# Altium project MSP-GSM.PRJPCB
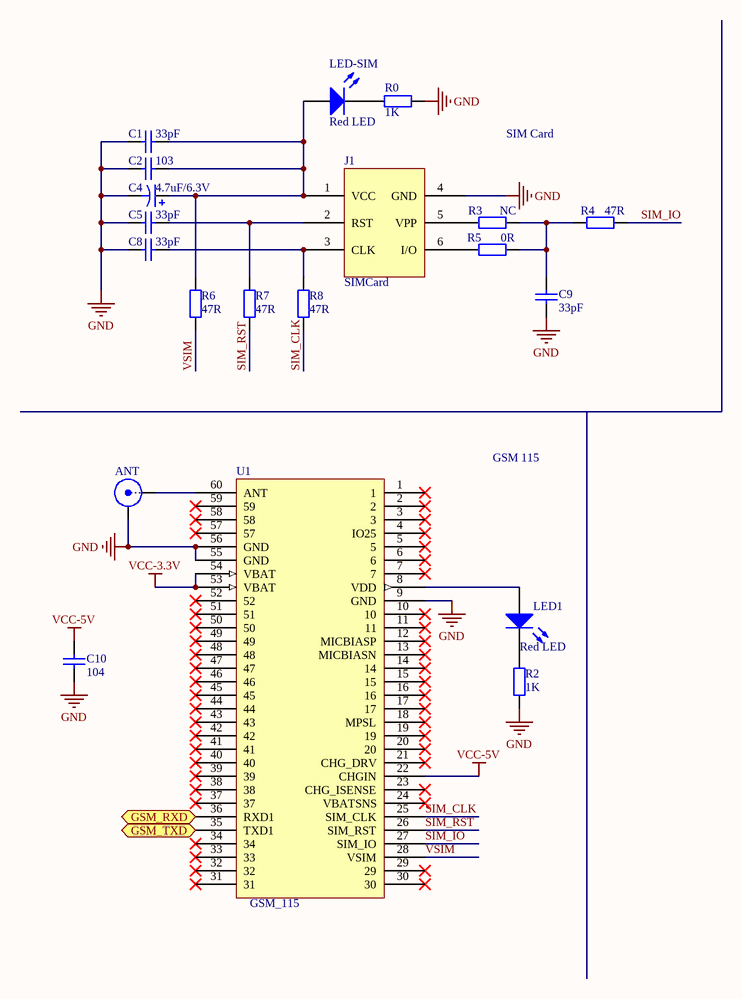
[diagram p0: GSMPart.SchDoc]
2 sheets, 94 parts. Net scope: flat (ports and power ports of the same name join across sheets).
Board file: MSP_GSM_Borad.PcbDoc
Sheets:
  GSMPart.SchDoc
  MSP.SchDoc

## Sheet GSMPart.SchDoc
size A

### Parts
ANT  SMB  [SMB_V-RJ45]  (value not drawn)
C1  value 33pF  [1608[0603]]  (hidden comment: Cap)
C2  value 103  [1608[0603]]  (hidden comment: Cap)
C4  value 4.7uF/6.3V  [B]  (hidden comment: CAP POL)
C5  value 33pF  [1608[0603]]  (hidden comment: Cap)
C8  value 33pF  [1608[0603]]  (hidden comment: Cap)
C9  value 33pF  [1608[0603]]  (hidden comment: Cap)
C10  value 104  [1608[0603]]  (hidden comment: Cap)
J1  SIMCard  [PCB_SIM]
LED1  Red LED  [2012[0805] - POL]
LED-SIM  Red LED  [2012[0805] - POL]
R0  value 1K  [1608[0603]]  (hidden comment: RES)
R2  value 1K  [1608[0603]]  (hidden comment: RES)
R3  value NC  [1608[0603]]  (hidden comment: RES)
R4  value 47R  [1608[0603]]  (hidden comment: RES)
R5  value 0R  [1608[0603]]  (hidden comment: RES)
R6  value 47R  [1608[0603]]  (hidden comment: RES)
R7  value 47R  [1608[0603]]  (hidden comment: RES)
R8  value 47R  [1608[0603]]  (hidden comment: RES)
U1  GSM_115

### Ports
GSM_RXD, GSM_TXD

### Nets
GND: ANT.2(Y) C1.1 C2.1 C4.2 C5.1 C8.1 C9.1 C10.1 J1.4(GND) R0.1 R2.1 U1.9(GND) U1.55(GND) U1.56(GND)
VCC-3.3V: U1.53(VBAT) U1.54(VBAT)
VCC-5V: C10.2 U1.22(CHGIN)
SIM_CLK: R8.1 U1.25(SIM_CLK)
SIM_IO: R4.2 U1.27(SIM_IO)
SIM_RST: R7.1 U1.26(SIM_RST)
VSIM: R6.1 U1.28(VSIM)
NetANT_1: ANT.1(X) U1.60(ANT)
NetC1_2: C1.2 C2.2 C4.1 J1.1(VCC) LED-SIM.1(A) R6.2
NetC5_2: C5.2 J1.2(RST) R7.2
NetC8_2: C8.2 J1.3(CLK) R8.2
NetC9_2: C9.2 R3.2 R4.1 R5.2
NetGSM_UART_3: U1.36(RXD1) ; port GSM_RXD
NetGSM_UART_4: U1.35(TXD1) ; port GSM_TXD
NetJ1_5: J1.5(VPP) R3.1
NetJ1_6: J1.6(I/O) R5.1
NetLED1_1: LED1.1(A) U1.8(VDD)
NetLED1_2: LED1.2(K) R2.2
NetLED-SIM_2: LED-SIM.2(K) R0.2

Not connected (* = marked no-connect by the designer): U1 1* 2* 3* 4(IO25)* 5* 6* 7* 10* 11* 12(MICBIASP)* 13(MICBIASN)* 14* 15* 16* 17* 18(MPSL)* 19* 20* 21(CHG_DRV)* 23(CHG_ISENSE)* 24(VBATSNS)* 29* 30* 31* 32* 33* 34* 37* 38* 39* 40* 41* 42* 43* 44* 45* 46* 47* 48* 49* 50* 51* 52* 57* 58* 59*

### Notes on the sheet
- SIM Card
- GSM 115

### Library data of the parts
ANT = SMB: SMB Straight Connector; LatestRevisionDate: 17-Jul-2002; LatestRevisionNote: Re-released for DXP Platform.; Publisher: Altium Limited
C1 C2 C5 C8-C10 = Cap: Capacitor; Published: 8-Jun-2000; LatestRevisionDate: 17-Jul-2002; LatestRevisionNote: Re-released for DXP Platform.; Publisher: Altium Limited
C4 = CAP POL: Polarized Capacitor (Axial); Published: 8-Jun-2000; LatestRevisionDate: 17-Jul-2002; LatestRevisionNote: Re-released for DXP Platform.; Publisher: Altium Limited
J1 = SIMCard: Sim Card
LED1 LED-SIM = LED
R0 R2-R8 = RES: Resistor; Published: 8-Jun-2000; LatestRevisionDate: 17-Jul-2002; LatestRevisionNote: Re-released for DXP Platform.; Publisher: Altium Limited
U1 = GSM115

## Sheet MSP.SchDoc
size A3; PageSetup: Record=PageOptions|CenterHorizontal=True|CenterVertical=True|PrintScale=0.71|XCorrection=1.00|YCorrection=1.00|PrintKind=1|BorderSize=5000000|LeftOffset=0|BottomOffset=0|Orientation=2|PaperLength=1000|PaperWidth=1000|Scale=100|PaperSource=7|PrintQuality=-4|MediaType=1|DitherType=10|PaperKind=A3|PrintScaleMode=1
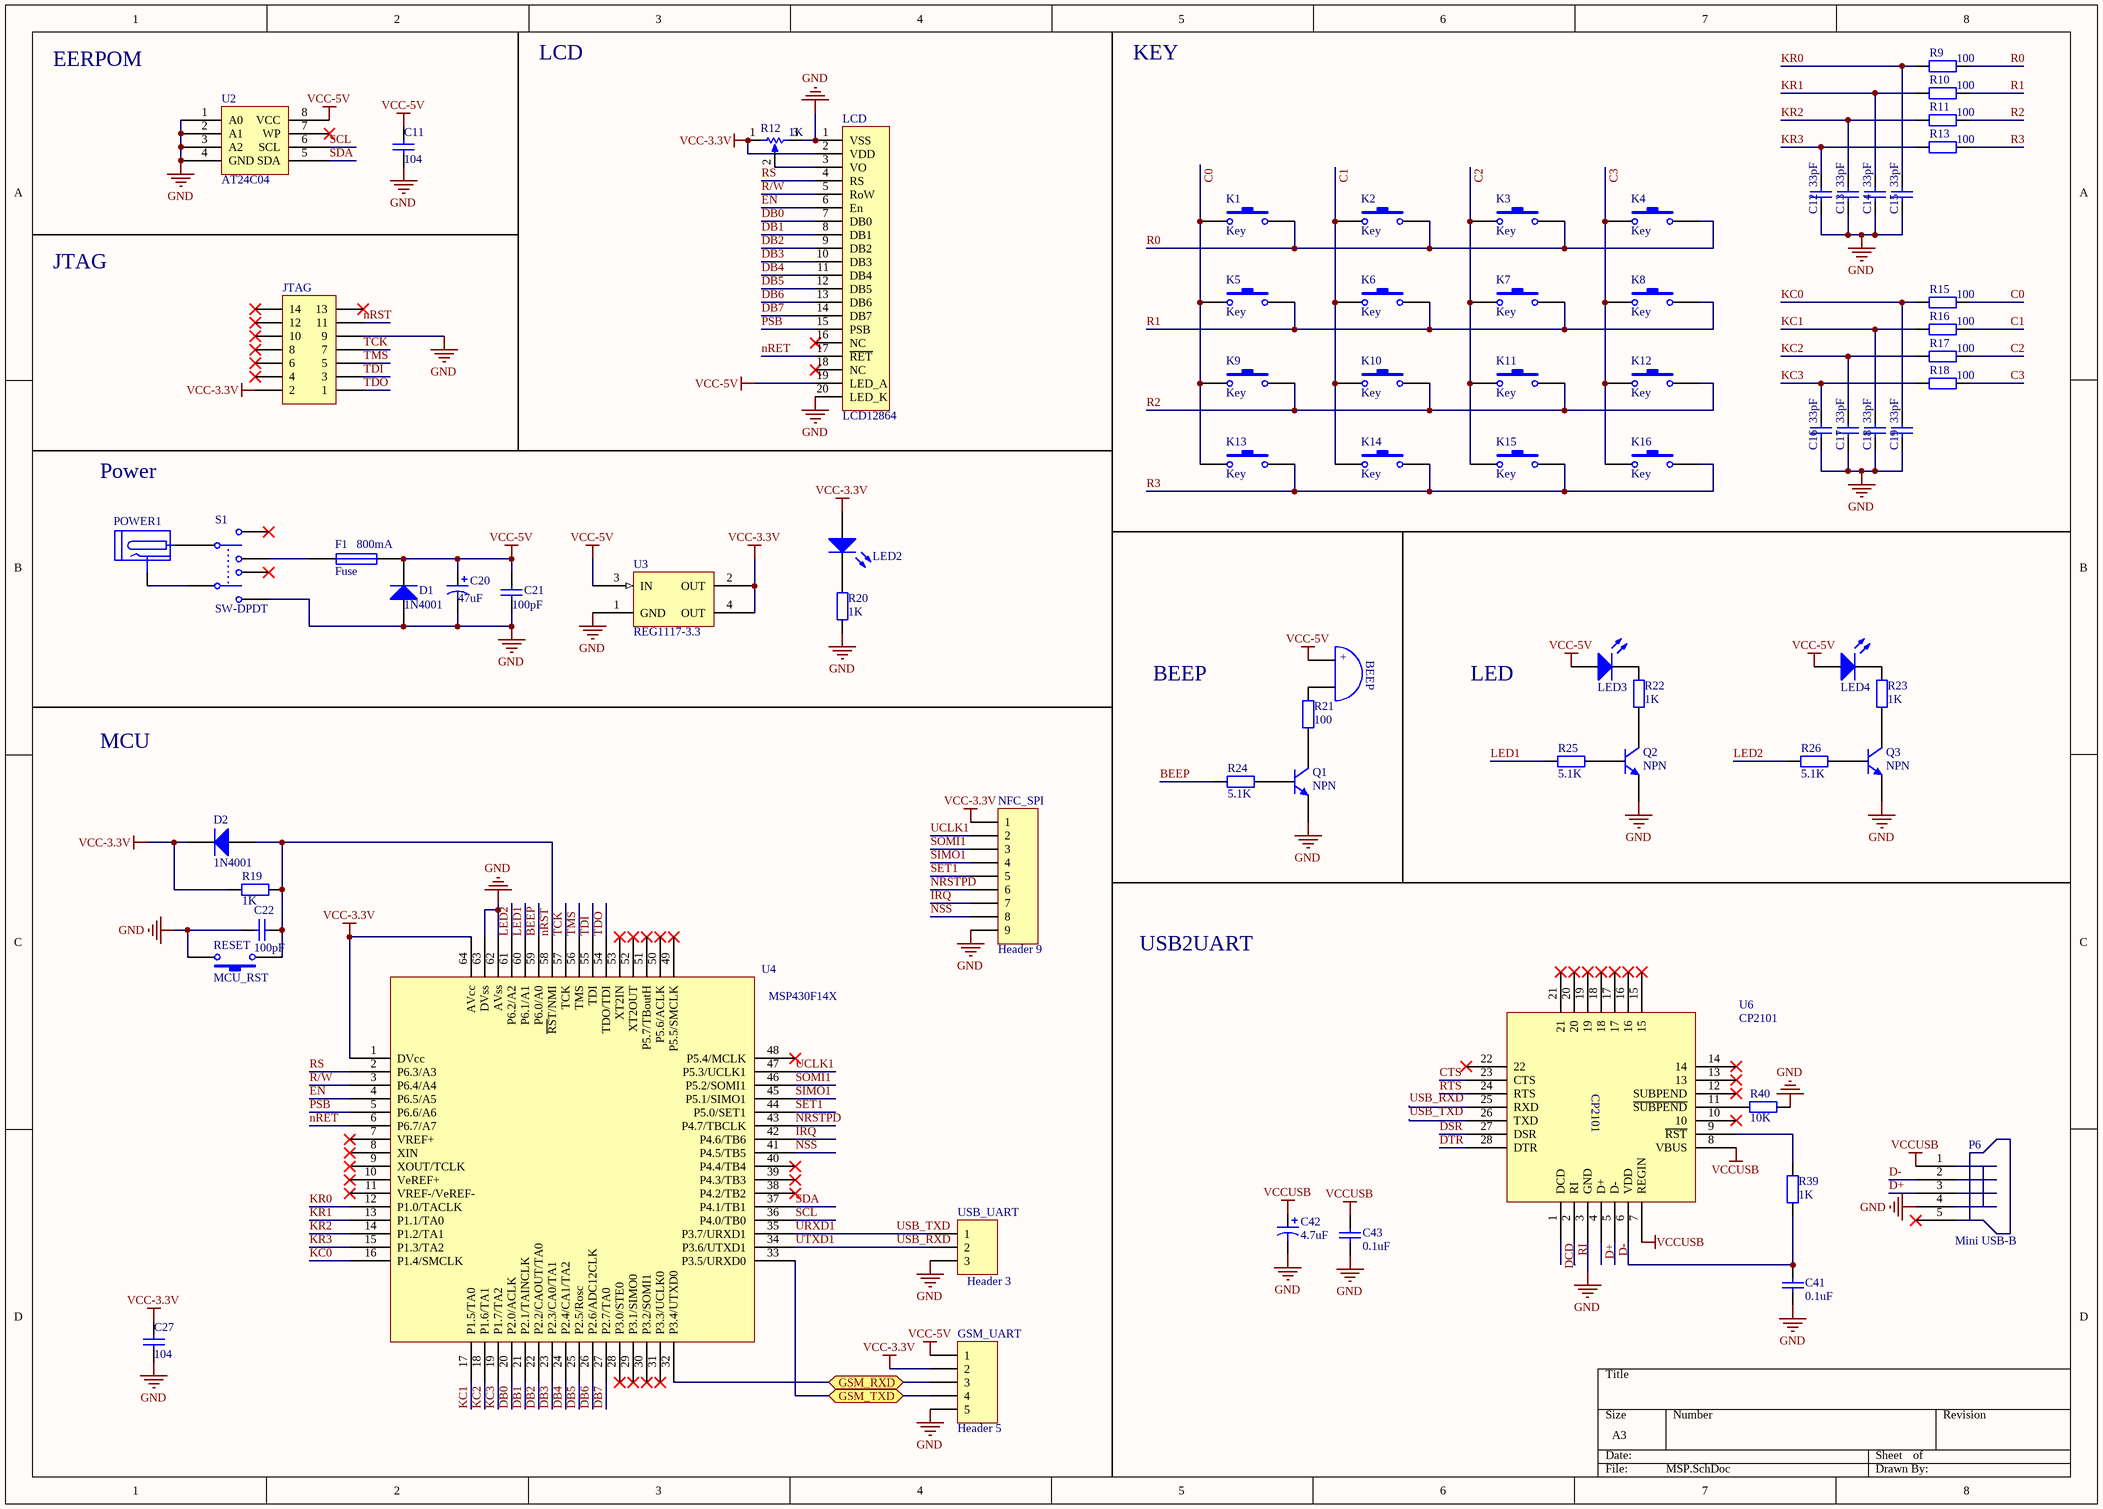
[diagram p1: MSP.SchDoc]

### Parts
BEEP1  BEEP  [BEEP]  (value not drawn)
C11  value 104  [1608[0603]]  (hidden comment: Cap)
C12  value 33pF  [1608[0603]]  (hidden comment: Cap)
C13  value 33pF  [1608[0603]]  (hidden comment: Cap)
C14  value 33pF  [1608[0603]]  (hidden comment: Cap)
C15  value 33pF  [1608[0603]]  (hidden comment: Cap)
C16  value 33pF  [1608[0603]]  (hidden comment: Cap)
C17  value 33pF  [1608[0603]]  (hidden comment: Cap)
C18  value 33pF  [1608[0603]]  (hidden comment: Cap)
C19  value 33pF  [1608[0603]]  (hidden comment: Cap)
C20  value 47uF  [B]  (hidden comment: CAP POL)
C21  value 100pF  [1608[0603]]  (hidden comment: Cap)
C22  value 100pF  [1608[0603]]  (hidden comment: Cap)
C27  value 104  [1608[0603]]  (hidden comment: Cap)
C41  value 0.1uF  [1608[0603]]  (hidden comment: Cap)
C42  value 4.7uF  [B]  (hidden comment: CAP POL)
C43  value 0.1uF  [1608[0603]]  (hidden comment: Cap)
D1  1N4001  [1608[0603] - POL]
D2  1N4001  [1608[0603] - POL]
F1  Fuse  Current: 800mA  [2012[0805]]
GSM_UART  Header 5  [HDR1X5]
JTAG  Header 7X2H  [HDR2X7H]  (value not drawn)
K1  Key  [Key-4]
K2  Key  [Key-4]
K3  Key  [Key-4]
K4  Key  [Key-4]
K5  Key  [Key-4]
K6  Key  [Key-4]
K7  Key  [Key-4]
K8  Key  [Key-4]
K9  Key  [Key-4]
K10  Key  [Key-4]
K11  Key  [Key-4]
K12  Key  [Key-4]
K13  Key  [Key-4]
K14  Key  [Key-4]
K15  Key  [Key-4]
K16  Key  [Key-4]
LCD  LCD12864  [LCD-20PIN]
LED2  LED  [2012[0805] - POL]  (value not drawn)
LED3  LED  [2012[0805] - POL]  (value not drawn)
LED4  LED  [2012[0805] - POL]  (value not drawn)
NFC_SPI  Header 9  [HDR1X9]
P6  Mini USB-B  [MINI USB-501]
POWER1  POWER  [POWER]  (value not drawn)
Q1  NPN  [SOT23-3L]
Q2  NPN  [SOT23-3L]
Q3  NPN  [SOT23-3L]
R9  value 100  [1608[0603]]  (hidden comment: RES)
R10  value 100  [1608[0603]]  (hidden comment: RES)
R11  value 100  [1608[0603]]  (hidden comment: RES)
R12  value 1K  [VR5]  (hidden comment: RPot)
R13  value 100  [1608[0603]]  (hidden comment: RES)
R15  value 100  [1608[0603]]  (hidden comment: RES)
R16  value 100  [1608[0603]]  (hidden comment: RES)
R17  value 100  [1608[0603]]  (hidden comment: RES)
R18  value 100  [1608[0603]]  (hidden comment: RES)
R19  value 1K  [1608[0603]]  (hidden comment: Res)
R20  value 1K  [1608[0603]]  (hidden comment: Res)
R21  value 100  [1608[0603]]  (hidden comment: Res)
R22  value 1K  [1608[0603]]  (hidden comment: Res)
R23  value 1K  [1608[0603]]  (hidden comment: Res)
R24  value 5.1K  [1608[0603]]  (hidden comment: Res)
R25  value 5.1K  [1608[0603]]  (hidden comment: Res)
R26  value 5.1K  [1608[0603]]  (hidden comment: Res)
R39  value 1K  [1608[0603]]  (hidden comment: Res)
R40  value 10K  [1608[0603]]  (hidden comment: Res)
RESET  MCU_RST  [Key-4]
S1  SW-DPDT  [SW-DPDT]
U2  AT24C04  [SOIC127P600-8AN]
U3  REG1117-3.3  [SOT223]
U4  MSP430F14X  [SQFP50P1200X1200-64N]
U6  CP2101  [QFN50P500X500-28VAN]
USB_UART  Header 3  [HDR1X3]

### Ports
GSM_RXD, GSM_TXD

### Nets
GND: C11.1 C12.2 C13.2 C14.2 C15.2 C16.2 C17.2 C18.2 C19.2 C20.2 C21.1 C22.2 C27.1 C41.1 C42.2 C43.1 D1.1(A) GSM_UART.5 JTAG.9 LCD.1(VSS) LCD.20(LED_K) NFC_SPI.9 P6.4 Q1.3(E) Q2.3(E) Q3.3(E) R12.3(BOT) R20.2 R40.2 RESET.2 S1.6 U2.1(A0) U2.2(A1) U2.3(A2) U2.4(GND) U3.1(GND) U4.62(AVss) U4.63(DVss) U6.3(GND) USB_UART.3
VCC-3.3V: C27.2 D2.2(K) GSM_UART.2 JTAG.2 LCD.2(VDD) LED2.1(A) NFC_SPI.1 R12.1(TOP) R19.2 U3.2(OUT) U3.4(OUT) U4.1(DVcc) U4.64(AVcc)
VCC-5V: BEEP1.1(B) C11.2 C20.1 C21.2 D1.2(K) F1.2 GSM_UART.1 LCD.19(LED_A) LED3.1(A) LED4.1(A) U2.8(VCC) U3.3(IN)
VCCUSB: C42.1 C43.2 P6.1 U6.7(REGIN) U6.8(VBUS)
BEEP: R24.1 U4.59(P6.0/A0)
C0: K1.1 K5.1 K9.1 K13.1 R15.2
C1: K2.1 K6.1 K10.1 K14.1 R16.2
C2: K3.1 K7.1 K11.1 K15.1 R17.2
C3: K4.1 K8.1 K12.1 K16.1 R18.2
CTS: U6.23(CTS)
D+: P6.3 U6.4(D+)
D-: P6.2 U6.5(D-)
DB0: LCD.7(DB0) U4.20(P2.0/ACLK)
DB1: LCD.8(DB1) U4.21(P2.1/TAINCLK)
DB2: LCD.9(DB2) U4.22(P2.2/CAOUT/TA0)
DB3: LCD.10(DB3) U4.23(P2.3/CA0/TA1)
DB4: LCD.11(DB4) U4.24(P2.4/CA1/TA2)
DB5: LCD.12(DB5) U4.25(P2.5/Rosc)
DB6: LCD.13(DB6) U4.26(P2.6/ADC12CLK)
DB7: LCD.14(DB7) U4.27(P2.7/TA0)
DCD: U6.1(DCD)
DSR: U6.27(DSR)
DTR: U6.28(DTR)
EN: LCD.6(En) U4.4(P6.5/A5)
IRQ: NFC_SPI.7 U4.42(P4.6/TB6)
KC0: C19.1 R15.1 U4.16(P1.4/SMCLK)
KC1: C18.1 R16.1 U4.17(P1.5/TA0)
KC2: C17.1 R17.1 U4.18(P1.6/TA1)
KC3: C16.1 R18.1 U4.19(P1.7/TA2)
KR0: C15.1 R9.1 U4.12(P1.0/TACLK)
KR1: C14.1 R10.1 U4.13(P1.1/TA0)
KR2: C13.1 R11.1 U4.14(P1.2/TA1)
KR3: C12.1 R13.1 U4.15(P1.3/TA2)
LED1: R25.1 U4.60(P6.1/A1)
LED2: R26.1 U4.61(P6.2/A2)
nRET: LCD.17(~{RET}) U4.6(P6.7/A7)
nRST: C22.1 D2.1(A) JTAG.11 R19.1 RESET.1 U4.58(~{RS}T/NMI)
NRSTPD: NFC_SPI.6 U4.43(P4.7/TBCLK)
NSS: NFC_SPI.8 U4.41(P4.5/TB5)
PSB: LCD.15(PSB) U4.5(P6.6/A6)
R0: K1.2 K2.2 K3.2 K4.2 R9.2
R1: K5.2 K6.2 K7.2 K8.2 R10.2
R2: K9.2 K10.2 K11.2 K12.2 R11.2
R3: K13.2 K14.2 K15.2 K16.2 R13.2
R/W: LCD.5(RoW) U4.3(P6.4/A4)
RI: U6.2(RI)
RS: LCD.4(RS) U4.2(P6.3/A3)
RTS: U6.24(RTS)
SCL: U2.6(SCL) U4.36(P4.0/TB0)
SDA: U2.5(SDA) U4.37(P4.1/TB1)
SET1: NFC_SPI.5 U4.44(P5.0/SET1)
SIMO1: NFC_SPI.4 U4.45(P5.1/SIMO1)
SOMI1: NFC_SPI.3 U4.46(P5.2/SOMI1)
TCK: JTAG.7 U4.57(TCK)
TDI: JTAG.3 U4.55(TDI)
TDO: JTAG.1 U4.54(TDO/TDI)
TMS: JTAG.5 U4.56(TMS)
UCLK1: NFC_SPI.2 U4.47(P5.3/UCLK1)
URXD1: U4.35(P3.7/URXD1) U6.26(TXD) USB_UART.1  [also labelled USB_TXD]
USB_RXD: U4.34(P3.6/UTXD1) U6.25(RXD) USB_UART.2  [also labelled UTXD1]
NetBEEP1_2: BEEP1.2(A) R21.1
NetC41_2: C41.2 R39.1 U6.6(VDD)
NetF1_1: F1.1 S1.3
NetGSM_UART_3: GSM_UART.3 U4.32(P3.4/UTXD0) ; port GSM_RXD
NetGSM_UART_4: GSM_UART.4 U4.33(P3.5/URXD0) ; port GSM_TXD
NetLCD_3: LCD.3(VO) R12.2(TAP)
NetLED2_2: LED2.2(K) R20.1
NetLED3_2: LED3.2(K) R22.1
NetLED4_2: LED4.2(K) R23.1
NetPOWER1_1: POWER1.1 S1.1
NetPOWER1_2: POWER1.2 S1.4
NetQ1_1: Q1.1(C) R21.2
NetQ1_2: Q1.2(B) R24.2
NetQ2_1: Q2.1(C) R22.2
NetQ2_2: Q2.2(B) R25.2
NetQ3_1: Q3.1(C) R23.2
NetQ3_2: Q3.2(B) R26.2
NetR39_2: R39.2 U6.9(~{RST})
NetR40_1: R40.1 U6.11(~{SUBPEND})

Not connected (* = marked no-connect by the designer): JTAG 4* 6* 8* 10* 12* 13* 14*; LCD 16(NC)* 18(NC)*; P6 5*; S1 2* 5*; U2 7(WP)*; U4 7(VREF+)* 8(XIN)* 9(XOUT/TCLK)* 10(VeREF+)* 11(VREF-/VeREF-)* 28(P3.0/STE0)* 29(P3.1/SIMO0)* 30(P3.2/SOMI1)* 31(P3.3/UCLK0)* 38(P4.2/TB2)* 39(P4.3/TB3)* 40(P4.4/TB4)* 48(P5.4/MCLK)* 49(P5.5/SMCLK)* 50(P5.6/ACLK)* 51(P5.7/TBoutH)* 52(XT2OUT)* 53(XT2IN)*; U6 10* 12(SUBPEND)* 13* 14* 15* 16* 17* 18* 19* 20* 21* 22*

### Notes on the sheet
- EERPOM
- LCD
- KEY
- JTAG
- Power
- BEEP
- LED
- MCU
- USB2UART
- (in symbol BEEP) +

### Library data of the parts
C11-C19 C21 C22 C27 C41 C43 = Cap: Capacitor; Published: 8-Jun-2000; LatestRevisionDate: 17-Jul-2002; LatestRevisionNote: Re-released for DXP Platform.; Publisher: Altium Limited
C20 C42 = CAP POL: Polarized Capacitor (Axial); Published: 8-Jun-2000; LatestRevisionDate: 17-Jul-2002; LatestRevisionNote: Re-released for DXP Platform.; Publisher: Altium Limited
D1 D2 = Diode 1N4001: 1 Amp General Purpose Rectifier; Revision 1: 11-Jul-2000: SIM Model Added.; Revision 2: 17-Jul-2002: Re-released for DXP Platform.; Package Information: Latest Revision: Aug-1999; Code - JEDEC: DO-204-AL; Published: 8-Jun-2000; Datasheet: Latest Revision: 1998; Package Reference: DO-41; Publisher: Altium Limited
F1 = FUSE1
GSM_UART = Header 5: Header, 5-Pin; LatestRevisionDate: 17-Jul-2002; LatestRevisionNote: Re-released for DXP Platform.; Publisher: Altium Limited
JTAG = Header 7X2H: Header, 7-Pin, Dual row, Right Angle; LatestRevisionDate: 17-Jul-2002; LatestRevisionNote: Re-released for DXP Platform.; Publisher: Altium Limited
K1-K16 RESET = SW-PB
NFC_SPI = Header 9: Header, 9-Pin; LatestRevisionDate: 17-Jul-2002; LatestRevisionNote: Re-released for DXP Platform.; Publisher: Altium Limited
P6 = USB: Mini USB Type B
Q1-Q3 = NPN: pin to pad: 1>3 2>1 3>2
R9-R11 R13 R15-R26 R39 R40 = RES: Resistor; Published: 8-Jun-2000; LatestRevisionDate: 17-Jul-2002; LatestRevisionNote: Re-released for DXP Platform.; Publisher: Altium Limited
R12 = RPot: Potentiometer; Sim Note: Enter the Resistance value and the set point into parameter fields.; Set Position: 0.5; Published: 8-Jun-2000; LatestRevisionDate: 17-Jul-2002; LatestRevisionNote: Re-released for DXP Platform.; PackageReference: VR5; Publisher: Altium Limited
S1 = SW-DPDT: Double-Pole, Double-Throw Switch; Published: 24-Mar-1999; Revision: July-2002: Re-released for DXP Platform.; Publisher: Altium Limited
USB_UART = Header 3: Header, 3-Pin; LatestRevisionDate: 17-Jul-2002; LatestRevisionNote: Re-released for DXP Platform.; Publisher: Altium Limited

## Nets that join several sheets
GND: GSMPart (14 pins), MSP (40 pins)
VCC-3.3V: GSMPart (U1.53 U1.54), MSP (13 pins)
VCC-5V: GSMPart (C10.2 U1.22), MSP (12 pins)
NetGSM_UART_3: GSMPart (U1.36), MSP (GSM_UART.3 U4.32)
NetGSM_UART_4: GSMPart (U1.35), MSP (GSM_UART.4 U4.33)